# EAGLE design dome-pcb (EAGLE 9.6.2)
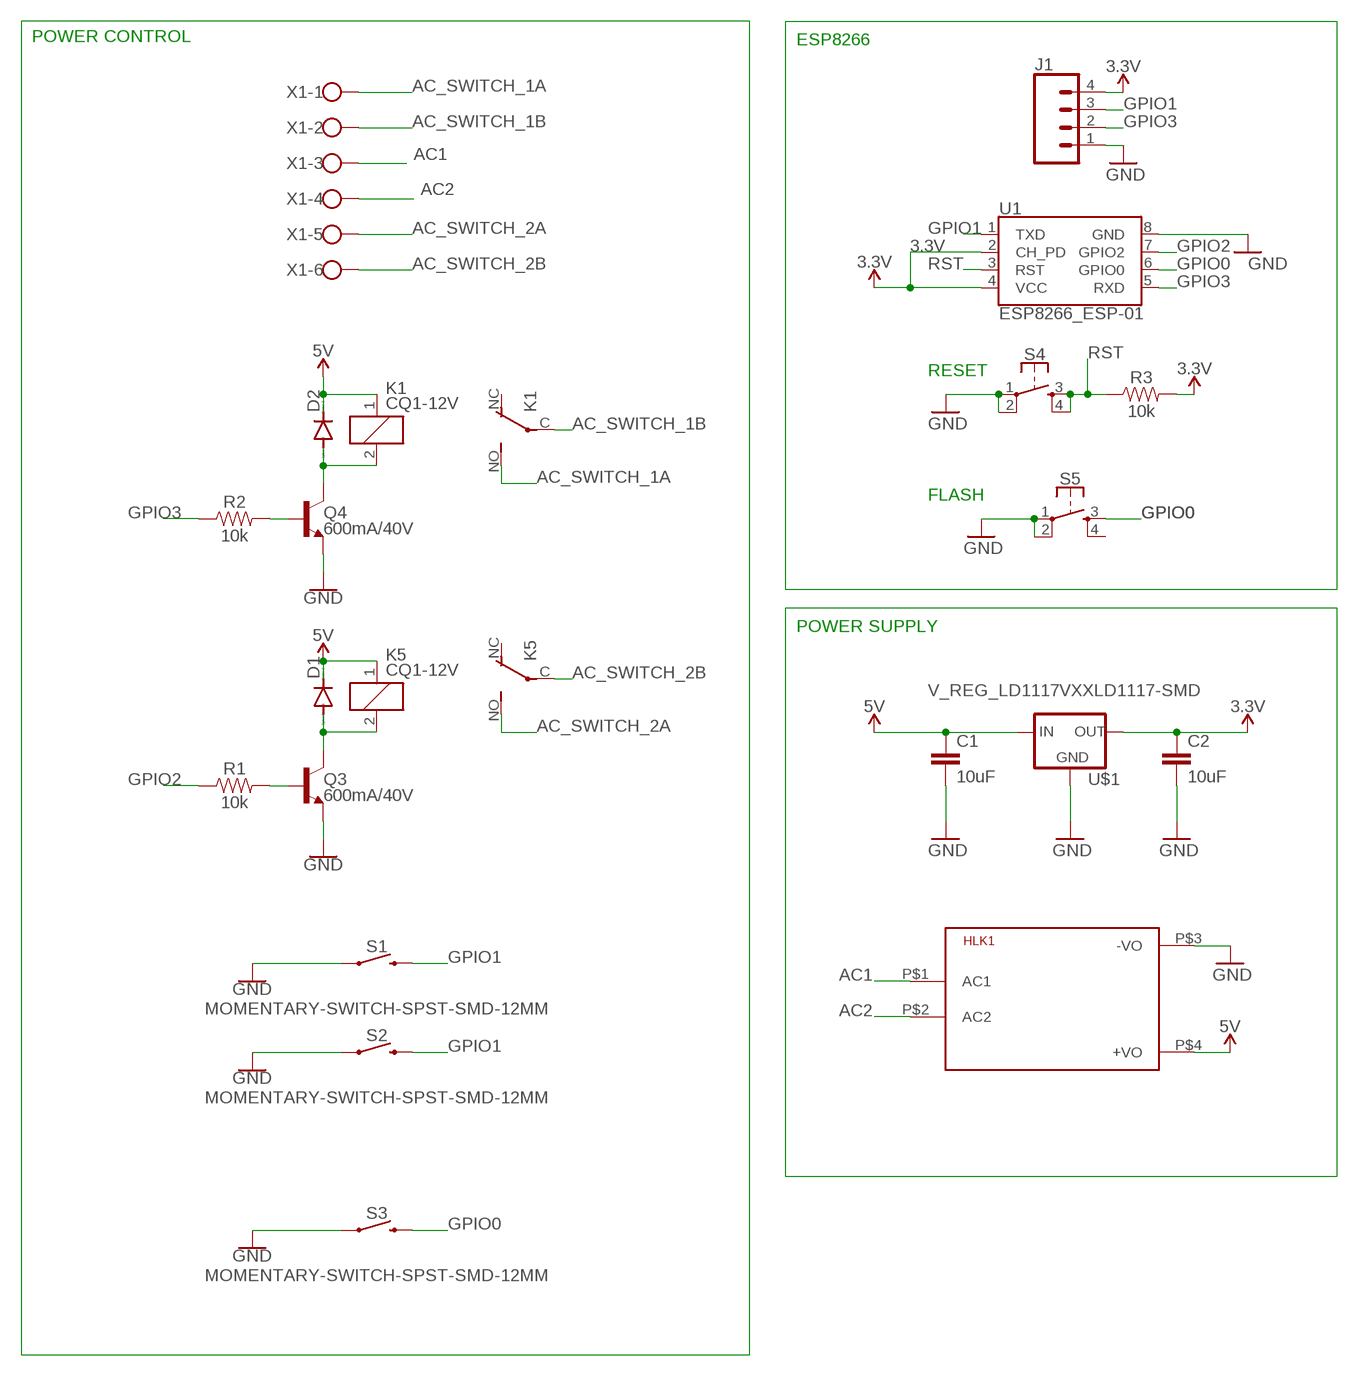
[diagram p0: schematic, sheet 1]

## Parts
C1  10uF  10UF-0603-6.3V-20%  [0603]
C2  10uF  10UF-0603-6.3V-20%  [0603]
D1  DIODE-DO-214AC  [DO-214AC]
D2  DIODE-DO-214AC  [DO-214AC]
HLK1  HLK-PM013W  [HLK-PM01]
J1  CONN_04PTH  [1X04]
K1  CQ1-12V  [CQ1]
K5  CQ1-12V  [CQ1]
Q3  600mA/40V  TRANS_NPN-MMBT2222AL  [SOT23-3]
Q4  600mA/40V  TRANS_NPN-MMBT2222AL  [SOT23-3]
R1  10k  10KOHM-0603-1/10W-1%  [0603]
R2  10k  10KOHM-0603-1/10W-1%  [0603]
R3  10k  10KOHM-0603-1/10W-1%  [0603]
S1  MOMENTARY-SWITCH-SPST-SMD-12MM  [TACTILE_SWITCH_SMD_12MM]
S2  MOMENTARY-SWITCH-SPST-SMD-12MM  [TACTILE_SWITCH_SMD_12MM]
S3  MOMENTARY-SWITCH-SPST-SMD-12MM  [TACTILE_SWITCH_SMD_12MM]
S4  MOMENTARY-SWITCH-SPST-2-SMD-5.2MM  [TACTILE_SWITCH_SMD_5.2MM]
S5  MOMENTARY-SWITCH-SPST-2-SMD-5.2MM  [TACTILE_SWITCH_SMD_5.2MM]
U1  ESP8266_ESP-01  [ESP8266_ESP-01]
U$1  V_REG_LD1117VXXLD1117-SMD  [SOT223]
X1  W237-6  [W237-6]

## Nets
3.3V: C2.1 J1.4 R3.2 U1.2(CH_PD) U1.4(VCC) U$1.2(OUT)
5V: C1.1 D1.C D2.C HLK1.P$4(+VO) K1.1 K5.1 U$1.3(IN)
AC1: HLK1.P$1(AC1) X1.3
AC2: HLK1.P$2(AC2) X1.4
AC_SWITCH_1A: K1.NO(2:S) X1.1
AC_SWITCH_1B: K1.C(2:P) X1.2
AC_SWITCH_2A: K5.NO(2:S) X1.5
AC_SWITCH_2B: K5.C(2:P) X1.6
GND: C1.2 C2.2 HLK1.P$3(-VO) J1.1 Q3.2(E) Q4.2(E) S1.1 S2.1 S3.1 S4.1 S4.2 S5.1 S5.2 U1.8(GND) U$1.1(GND)
GPIO0: S3.3 S5.3 U1.6(GPIO0)
GPIO1: J1.3 S1.3 S2.3 U1.1(TXD)
GPIO2: R1.1 U1.7(GPIO2)
GPIO3: J1.2 R2.1 U1.5(RXD)
N$9: D2.A K1.2 Q4.3(C)
N$10: Q4.1(B) R2.2
N$11: D1.A K5.2 Q3.3(C)
N$12: Q3.1(B) R1.2
RST: R3.1 S4.3 S4.4 U1.3(RST)
Unconnected: K1.NC(2:O) K5.NC(2:O) S5.4

## Notes on the sheet
- POWER CONTROL | ESP8266
- RESET
- FLASH
- POWER SUPPLY

## Library data of the parts
C1 C2 = Capacitors:10UF: 10.0µF ceramic capacitors A capacitor is a passive two-terminal electrical component used to store electrical energy temporarily in an electric field.; PROD_ID: CAP-11015
D1 D2 = diode:DIODE-: DIODE
HLK1 = HLK-PM01:HLK-PM01: Hi-Link Power Supply HLK-PM01 3W Author: Ahmed Said <https://github.com/AhmedSaid/EAGLELibraries>
J1 = Connectors:CONN_04: Multi connection point. Often used as Generic Header-pin footprint for 0.1 inch spaced/style header connections On any of the 0.1 inch spaced packages, you can populate with these: Break Away Headers - Straight <https://www.sparkfun.com/products/116> (PRT-00116) Break Away Male Headers - Right Angle <https://www.sparkfun.com/products/553> (PRT-00553) Female Headers <https://www.sparkfun.com/products/115> (PRT-00115) Break Away Headers - Machine Pin <https://www.sparkfun.com/products/117> (PRT-00117) Break Away Female Headers - Swiss Machine Pin <https://www.sparkfun.com/products/743> (PRT-00743) For SCREWTERMINALS and SPRING TERMINALS visit here: Screw Terimnals on SparkFun.com <https://www.sparkfun.com/search/results?term=Screw+Terminals> (5mm/3.5mm/2.54mm spacing) This device is also useful as a general connection point to wire up your design to another part of your project. Our various solder wires solder well into these plated through hole pads. Hook-Up Wire - Assortment (Stranded, 22 AWG) <https://www.sparkfun.com/products/11375> (PRT-11375) Hook-Up Wire - Assortment (Solid Core, 22 AWG) <https://www.sparkfun.com/products/11367> (PRT-11367) View the entire wire category on our website here <https://www.sparkfun.com/categories/141> Special notes: Molex polarized connector foot print use with SKU : PRT-08231 with associated crimp pins and housings. 1MM SMD Version SKU: PRT-10208; PROD_ID: CONN-09696
K1 K5 = relay:CQ1-12V: AUTOMOTIVE QUIET RELAY NAiS Source: http://www.mew-europe.com/.. en_ds_61208_0000.pdf; OC_FARNELL: unknown; OC_NEWARK: unknown
Q3 Q4 = DiscreteSemi:TRANS_NPN: NPN transistor Current controlled devices typically used to amplify current or used as a switch. BC547 - COM-08928 <http://www.sparkfun.com/products/8928> (TO-92 45V 100mA) (1.Collector 2.Base 3.Emitter) 2N3904 - COM-00521 <http://www.sparkfun.com/products/521> (TO-92 40V 200mA) (1.Emitter 2.Base 3.Collector) P2N2222A - COM-12852 <http://www.sparkfun.com/products/12852> (TO-92 40V 600mA) (1.Collector 2.Base 3.Emitter); PROD_ID: TRANS-08049
R1-R3 = Resistors:10KOHM: 10kΩ resistor A resistor is a passive two-terminal electrical component that implements electrical resistance as a circuit element. Resistors act to reduce current flow, and, at the same time, act to lower voltage levels within circuits. - Wikipedia; PROD_ID: RES-00824
S1-S3 = Switches:MOMENTARY-SWITCH-SPST: Momentary Switch (Pushbutton) - SPST Normally-open (NO) SPST momentary switches (buttons, pushbuttons). Variants PTH-12MM - 12mm square, through-hole Momentary Pushbutton Switch - 12mm Square <https://www.sparkfun.com/products/9190> (COM-09190) PTH-6.0MM, PTH-6.0MM-KIT - 6.0mm square, through-hole Mini Pushbutton Switch <https://www.sparkfun.com/products/97> (COM-00097) KIT package intended for soldering kit's - only one side of pads' copper is exposed. PTH-RIGHT-ANGLE-KIT - Right-angle, through-hole Right Angle Tactile Button <https://www.sparkfun.com/products/10791> - Used on SparkFun BigTime Watch Kit <https://www.sparkfun.com/products/11734> SMD-12MM - 12mm square, surface-mount Tactile Button - SMD (12mm) <https://www.sparkfun.com/products/12993> (COM-12993) Used on SparkFun PicoBoard <https://www.sparkfun.com/products/11888> SMD-4.5MM - 4.5mm Square Trackball Switch Used on SparkFun Blackberry Trackballer Breakout <https://www.sparkfun.com/products/13169> SMD-4.6MMX2.8MM - 4.60mm x 2.80mm, surface mount Used on SparkFun SAMD21 Mini Breakout <https://www.sparkfun.com/products/13664> SMD-5.2MM, SMD-5.2-REDUNDANT - 5.2mm square, surface-mount Mini Pushbutton Switch - SMD <https://www.sparkfun.com/products/8720> (COM-08720) Used on Arduino Pro Mini <https://www.sparkfun.com/products/11114> REDUNDANT package connects both switch circuits together SMD-6.0X3.5MM - 6.0 x 3.5mm, surface mount Momentary Reset Switch SMD <https://www.sparkfun.com/products/8229> (COM-08229) SMD-6.2MM-TALL - 6.2mm square, surface mount Tactile Button - SMD (6mm) <https://www.sparkfun.com/products/12992> Used on SparkFun Digital Sandbox <https://www.sparkfun.com/products/12651> SMD-RIGHT-ANGLE - Right-angle, surface mount Used on SparkFun Block for Intel® Edison - Arduino <https://www.sparkfun.com/products/13036>; PROD_ID: SWCH-11967; SF_SKU: COM-12993
S4 S5 = Switches:MOMENTARY-SWITCH-SPST-2: Momentary Switch (Pushbutton) - SPST - Two Circuits Normally-open (NO) SPST momentary switches (buttons, pushbuttons). Schematic symbol includes two switch circuits. Variants SMD-4.6MMX2.8MM - 4.60mm x 2.80mm Tactile Momentary Button Switch - Used on SparkFun SAMD21 Mini Breakout <https://www.sparkfun.com/products/13664> SMD-5.2MM - Mini Pushbutton Switch - SMD <https://www.sparkfun.com/products/8720> - Used on Arduino Pro Mini <https://www.sparkfun.com/products/11114>; PROD_ID: SWCH-08247; SF_SKU: COM-08720
U1 = RF:ESP8266_ESP-01: ESP8266 ESP-01 Module The ESP8266 WiFi Module is a self contained SOC with integrated TCP/IP protocol stack that can give any microcontroller access to your WiFi network. The ESP8266 is capable of either hosting an application or offloading all Wi-Fi networking functions from another application processor. Each ESP8266 module comes pre-programmed with an AT command set firmware, meaning, you can simply hook this up to your Arduino device and get about as much WiFi-ability as a WiFi Shield offers (and that’s just out of the box)! The ESP8266 module is an extremely cost effective board with a huge, and ever growing, community. This module has a powerful enough on-board processing and storage capability that allows it to be integrated with the sensors and other application specific devices through its GPIOs with minimal development up-front and minimal loading during runtime. Its high degree of on-chip integration allows for minimal external circuitry, including the front-end module, is designed to occupy minimal PCB area. The ESP8266 supports APSD for VoIP applications and Bluetooth co-existance interfaces, it contains a self-calibrated RF allowing it to work under all operating conditions, and requires no external RF parts. SparkFun Product Page <https://www.sparkfun.com/products/13678>; SF_ID: WRL-13678
U$1 = Power:V_REG_LD1117VXX: LD1117VXX voltage regulator. We carry the 3.3V version (COM-00526) in TO-220 package.; PROD_ID: VREG-13917
X1 = Borneras:W237-6: WAGO SCREW CLAMP; OC_FARNELL: unknown; OC_NEWARK: unknown

## Board
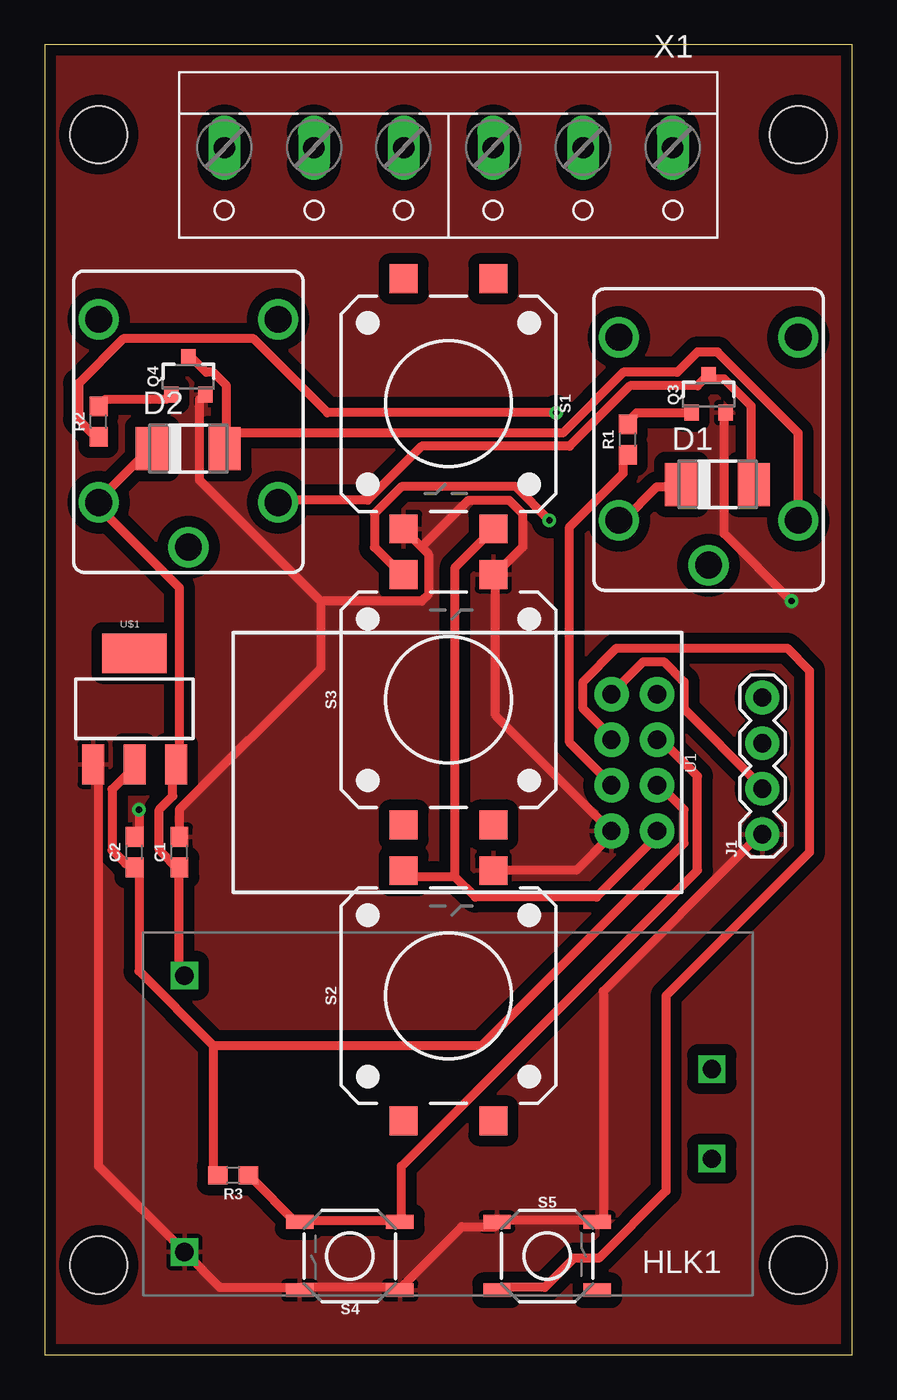
[diagram p1: board, top side]
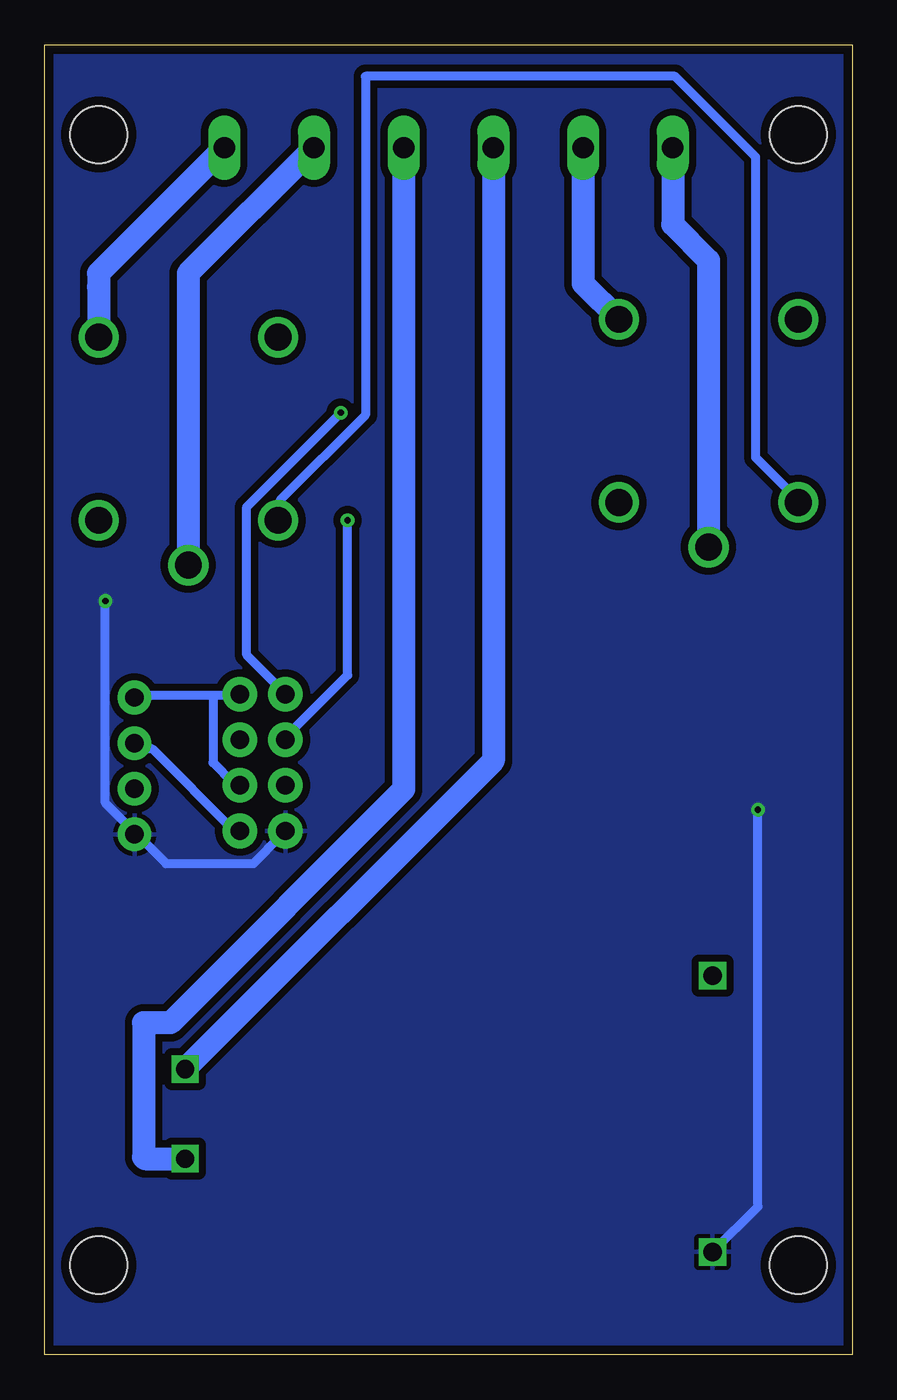
[diagram p2: board, bottom side, seen from below]

Size 45 x 73 mm. Coordinates in mm from the lower left corner, seen from the top.
Outline: 0,0 45,0 45,73 0,73 0,0
Copper layers (1*16): Top 0.035mm / dielectric 0.15mm / Bottom 0.035mm
Design rules "default *": minimum track width 0.5mm, minimum drill 0.35mm, track to track 0.25mm, track to pad 0.25mm, pad to pad 0.25mm, via to via 0.25mm, smd to smd 6mil, copper to edge 0.5mm, drill to drill 0.3mm, minimum pad ring 10mil, minimum via ring 8mil, stop-mask expansion 4mil, vias tented up to drill 0mil, thermal gap 10mil
Holes 3.2 mm at 3,68 42,68 42,5 3,5

### Footprints (pad centres in the part's own frame; a part is rotated, then mirrored left to right if it is on the bottom)
0603 = smd 1.1 x 1: 1 -0.85,0; 2 0.85,0
DO-214AC = smd 1.8 x 2.4: A 2.025,0; C -2.025,0
HLK-PM01 = drill 1.016 square: P$1 -14.7,2.5; P$2 -14.7,-2.5; P$3 14.7,7.7; P$4 14.7,-7.7
1X04 = drill 1.016 pad 1.88: 1 0,0; 2 2.54,0; 3 5.08,0; 4 7.62,0
CQ1 = drill 1.5: 1 4.5,-5; 2 4.5,5; C 7,0; NC -5.7,-5; NO -5.7,5
SOT23-3 = smd 0.8 x 0.9: 1 -0.95,-1; 2 0.95,-1; 3 0,1.1
TACTILE_SWITCH_SMD_12MM = smd 1.6 x 1.55: 1 6.975,-2.5; 2 -6.975,-2.5; 3 6.975,2.5; 4 -6.975,2.5
TACTILE_SWITCH_SMD_5.2MM = smd 1.524 x 0.762: 1 -2.794,1.905; 2 2.794,1.905; 3 -2.794,-1.905; 4 2.794,-1.905
ESP8266_ESP-01 = drill 1.016 pad 1.93: 1 -3.81,-11.13; 2 -1.27,-11.13; 3 1.27,-11.13; 4 3.81,-11.13; 5 3.81,-8.59; 6 1.27,-8.59; 7 -1.27,-8.59; 8 -3.81,-8.59
SOT223 = smd 1.219 x 2.235: 1 -2.311,-3.099; 2 0,-3.099; 3 2.311,-3.099 | smd 3.6 x 2.2: 4 0,3.099
W237-6 = drill 1.194 long: 1 -12.5,-1.27; 2 -7.5,-1.27; 3 -2.5,-1.27; 4 2.5,-1.27; 5 7.5,-1.27; 6 12.5,-1.27

### Placement (x,y rotation side)
C1  7.5,28 90 top
C2  5,28 90 top
D1  37.5,48.5 0 top
D2  8,50.5 0 top
HLK1  22.48,13.42 180 top
J1  40,29 90 top
K1  37,51 270 top
K5  8,52 270 top
Q3  37,53.5 0 top
Q4  8,54.5 0 top
R1  32.5,51 90 top
R2  3,52 90 top
R3  10.5,10 180 top
S1  22.5,53 270 top
S2  22.5,20 90 top
S3  22.5,36.5 90 top
S4  17,5.5 180 top
S5  28,5.5 0 top
U1  23,33 90 top
U$1  5,36 0 top
X1  22.5,66 180 top

### Tracks (layer width: path | path; a pad name or v marks a point on that pad's centre or on a via)
3.3V
  Top 0.5: U$1.2 4.88,32.62 3.75,31.5 3.75,28.12 4.5,27.38 4.88,27.38 C2.1 5.25,27 5.25,21.38 9.38,17.25 | 9.38,17.25 9.38,10.12 R3.2 | 9.38,17.25 24.38,17.25 35.62,28.5 35.62,30.38 34.5,31.5 U1.2
  Bottom 0.5: 35.62,36.75 34.5,36.75 U1.4 | 35.62,36.75 39.75,36.75 J1.4 | 35.62,36.75 35.62,33 34.5,31.88 U1.2
5V
  Top 0.5: 7.5,27 7.5,21.38 HLK1.P$4 | 7.5,27 6.38,28.12 6.38,30.38 7.12,31.12 7.12,32.62 U$1.3 7.5,33 7.5,42.75 3,47.25 K5.1 3,47.62 5.62,50.25 D2.C | 7.5,27 C1.1 | D1.C 35.25,48.38 34.12,48.38 32.25,46.5 K1.1
  Bottom 0.5: K1.1 31.88,46.5 31.88,47.62 27.12,52.38 27.12,71.25 9.88,71.25 5.38,66.75 5.38,50 3,47.62 K5.1
AC1
  Bottom 1.27: X1.3 25,31.5 38,18.5 39.5,18.5 39.5,11 39.42,10.92 HLK1.P$1
AC2
  Bottom 1.27: X1.4 20,33.1 HLK1.P$2
AC_SWITCH_1A
  Bottom 1.27: 42,59.5 K1.NO 42,60.27 X1.1
AC_SWITCH_1B
  Bottom 1.27: X1.2 37,60.27 K1.C
AC_SWITCH_2A
  Bottom 1.27: X1.5 15,59.7 K5.NO
AC_SWITCH_2B
  Bottom 1.27: X1.6 10,63 8,61 K5.C
GND  (via drill 0.35)
  Top 0.5: v5.25,30.38 5.25,28.88 C2.2 | U$1.1 3,32.62 3,10.5 HLK1.P$3 9.75,3.75 13.88,3.75 S4.2 14.25,3.75 19.5,3.75 S4.1 19.88,3.75 23.25,7.12 25.12,7.12 S5.1 25.5,7.5 30.75,7.5 S5.2 31.12,7.5 31.12,20.25 39.75,28.88 J1.1 | 15.38,42 8.62,48.75 8.62,53.25 Q4.2 | 15.38,42 21,42 21.38,42.38 21.38,44.62 21,45 | 21,45 20.25,45.75 S1.1 | C1.2 7.5,30.38 15.38,38.25 15.38,42 | 21,45 23.62,47.62 25.88,47.62 26.62,46.88 26.62,45 25.12,43.5 S3.1 25.12,43.12 25.12,35.62 31.5,29.25 U1.8 31.5,28.88 29.62,27 25.12,27 S2.1 | v41.62,42 37.88,45.75 37.88,52.5 Q3.2
  Bottom 0.5: v5.25,30.38 5.25,8.25 HLK1.P$3 | v41.62,42 41.62,30.75 40.12,29.25 J1.1 39.75,28.88 38.25,27.38 33.38,27.38 31.88,28.88 U1.8
  pour Top (isolate 0.61): 0,0 45,0 45,73 0,73
  pour Bottom (isolate 0.406): 0,0 45,0 45,73 0,73
GPIO0  (via drill 0.35)
  Top 0.5: S5.3 25.5,3.75 27.88,3.75 29.5,5.38 30.88,5.38 34.62,9.12 34.62,20 42.62,28 42.62,38.12 41.38,39.38 31.88,39.38 30,37.5 30,36 31.5,34.5 U1.6 | v28.12,46.5 26.25,48.38 19.88,48.38 18.38,46.88 18.38,45 19.88,43.5 S3.3
  Bottom 0.5: v28.12,46.5 28.12,37.88 31.5,34.5 U1.6
GPIO1
  Top 0.5: 22.88,26.62 20.25,26.62 S2.3 | 22.88,26.62 24,25.5 30.75,25.5 34.12,28.88 U1.1 | 22.88,26.62 22.88,43.88 24.75,45.75 S1.3
  Bottom 0.5: J1.3 39.75,33.75 39,33.75 34.5,29.25 U1.1
GPIO2
  Top 0.5: R1.1 32.25,49.88 32.25,49.12 29.25,46.12 29.25,34.12 31.5,31.88 U1.7
GPIO3  (via drill 0.35)
  Top 0.5: v28.5,52.5 15.75,52.5 11.62,56.62 4.38,56.62 1.88,54.12 1.88,52.12 2.62,51.38 3,51.38 R2.1 | J1.2 39.75,31.88 35.62,36 35.62,37.5 34.5,38.62 33.38,38.62 31.88,37.12 U1.5
  Bottom 0.5: v28.5,52.5 33.75,47.25 33.75,39 31.88,37.12 U1.5
N$9
  Top 0.5: 10.12,51.38 10.12,50.62 D2.A 10.12,51.38 | 10.12,51.38 10.12,54 9.38,54.75 9,54.75 8.25,55.5 Q4.3 | 10.12,51.38 28.88,51.38 32.25,54.75 35.25,54.75 36.38,55.88 37.5,55.88 42,51.38 K1.2
N$10
  Top 0.5: Q4.1 6.75,53.25 3.38,53.25 3,52.88 R2.2
N$11
  Top 0.5: D1.A 39.38,48.75 39.38,52.88 37.88,54.38 37.12,54.38 Q3.3 36.75,54.38 36.38,54 32.62,54 29.25,50.62 21,50.62 18,47.62 13.12,47.62 K5.2
N$12
  Top 0.5: Q3.1 33,52.5 32.62,52.12 R1.2
RST
  Top 0.5: R3.1 11.62,9.75 13.88,7.5 S4.4 14.25,7.5 19.5,7.5 S4.3 19.88,7.5 19.88,10.5 36.38,27 36.38,32.25 34.5,34.12 U1.3